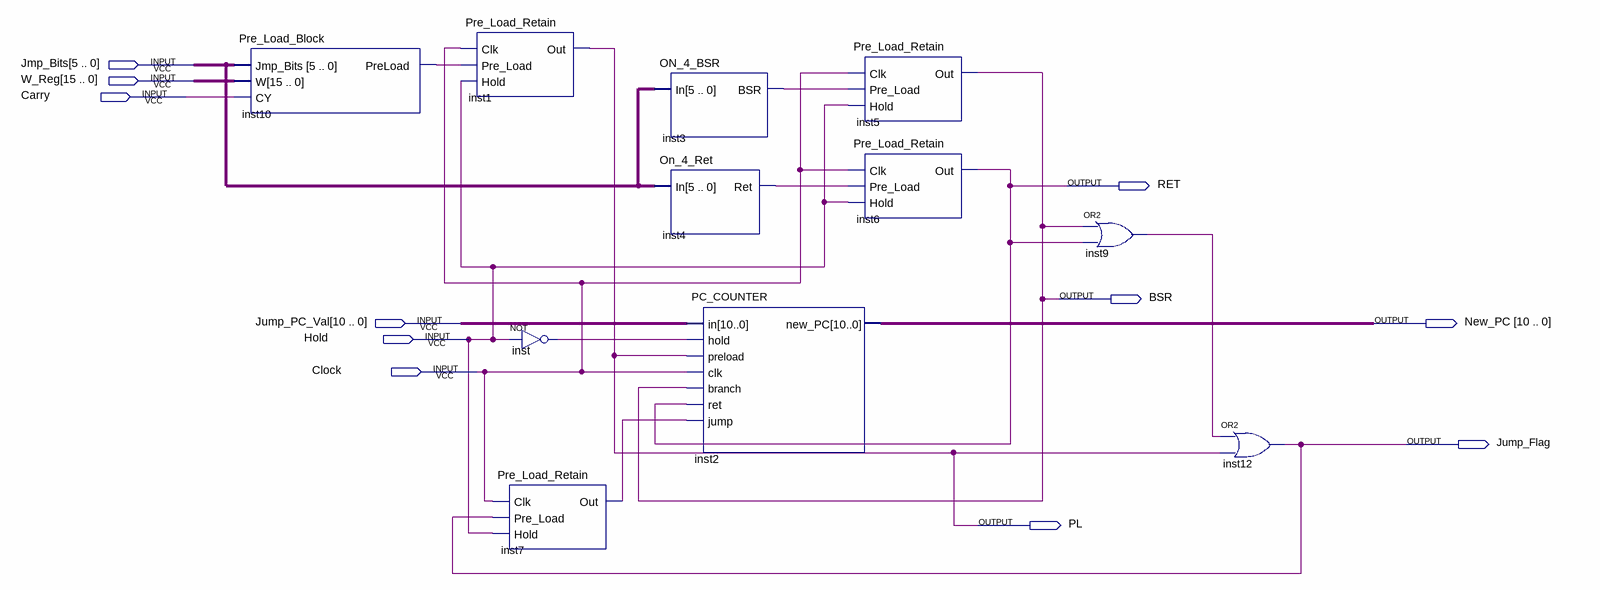
[diagram p0: schematic sheet]
// Quartus schematic Jump_Module.bdf as structural Verilog: 11 symbols, 11 pins
module Jump_Module (
  input  [5:0] Jmp_Bits,
  input  [15:0] W_Reg,
  input  Carry,
  input  [10:0] Jump_PC_Val,
  input  Hold,
  input  Clock,
  output RET,
  output BSR,
  output [10:0] New_PC,
  output Jump_Flag,
  output PL
);

  wire inst3_bsr, inst4_ret, inst7_out, inst9_out, inst10_preload, inst_out;

  Pre_Load_Block inst10 (.Jmp_Bits(Jmp_Bits), .W(W_Reg), .CY(Carry), .PreLoad(inst10_preload));
  Pre_Load_Retain inst1 (.Clk(Clock), .Pre_Load(inst10_preload), .Hold(Hold), .Out(PL));
  Pre_Load_Retain inst7 (.Clk(Clock), .Pre_Load(Jump_Flag), .Hold(Hold), .Out(inst7_out));
  not inst (inst_out, Hold);
  ON_4_BSR inst3 (.In(Jmp_Bits), .BSR(inst3_bsr));
  On_4_Ret inst4 (.In(Jmp_Bits), .Ret(inst4_ret));
  PC_COUNTER inst2 (
    .in(Jump_PC_Val), .hold(inst_out), .preload(PL), .clk(Clock), .branch(BSR), .ret(RET), .jump(inst7_out),
    .new_PC(New_PC));
  Pre_Load_Retain inst5 (.Clk(Clock), .Pre_Load(inst3_bsr), .Hold(Hold), .Out(BSR));
  Pre_Load_Retain inst6 (.Clk(Clock), .Pre_Load(inst4_ret), .Hold(Hold), .Out(RET));
  or inst9 (inst9_out, BSR, RET);
  or inst12 (Jump_Flag, inst9_out, PL);
endmodule
